# EAGLE design MiSTer_LLOAD (EAGLE 6.6.0)
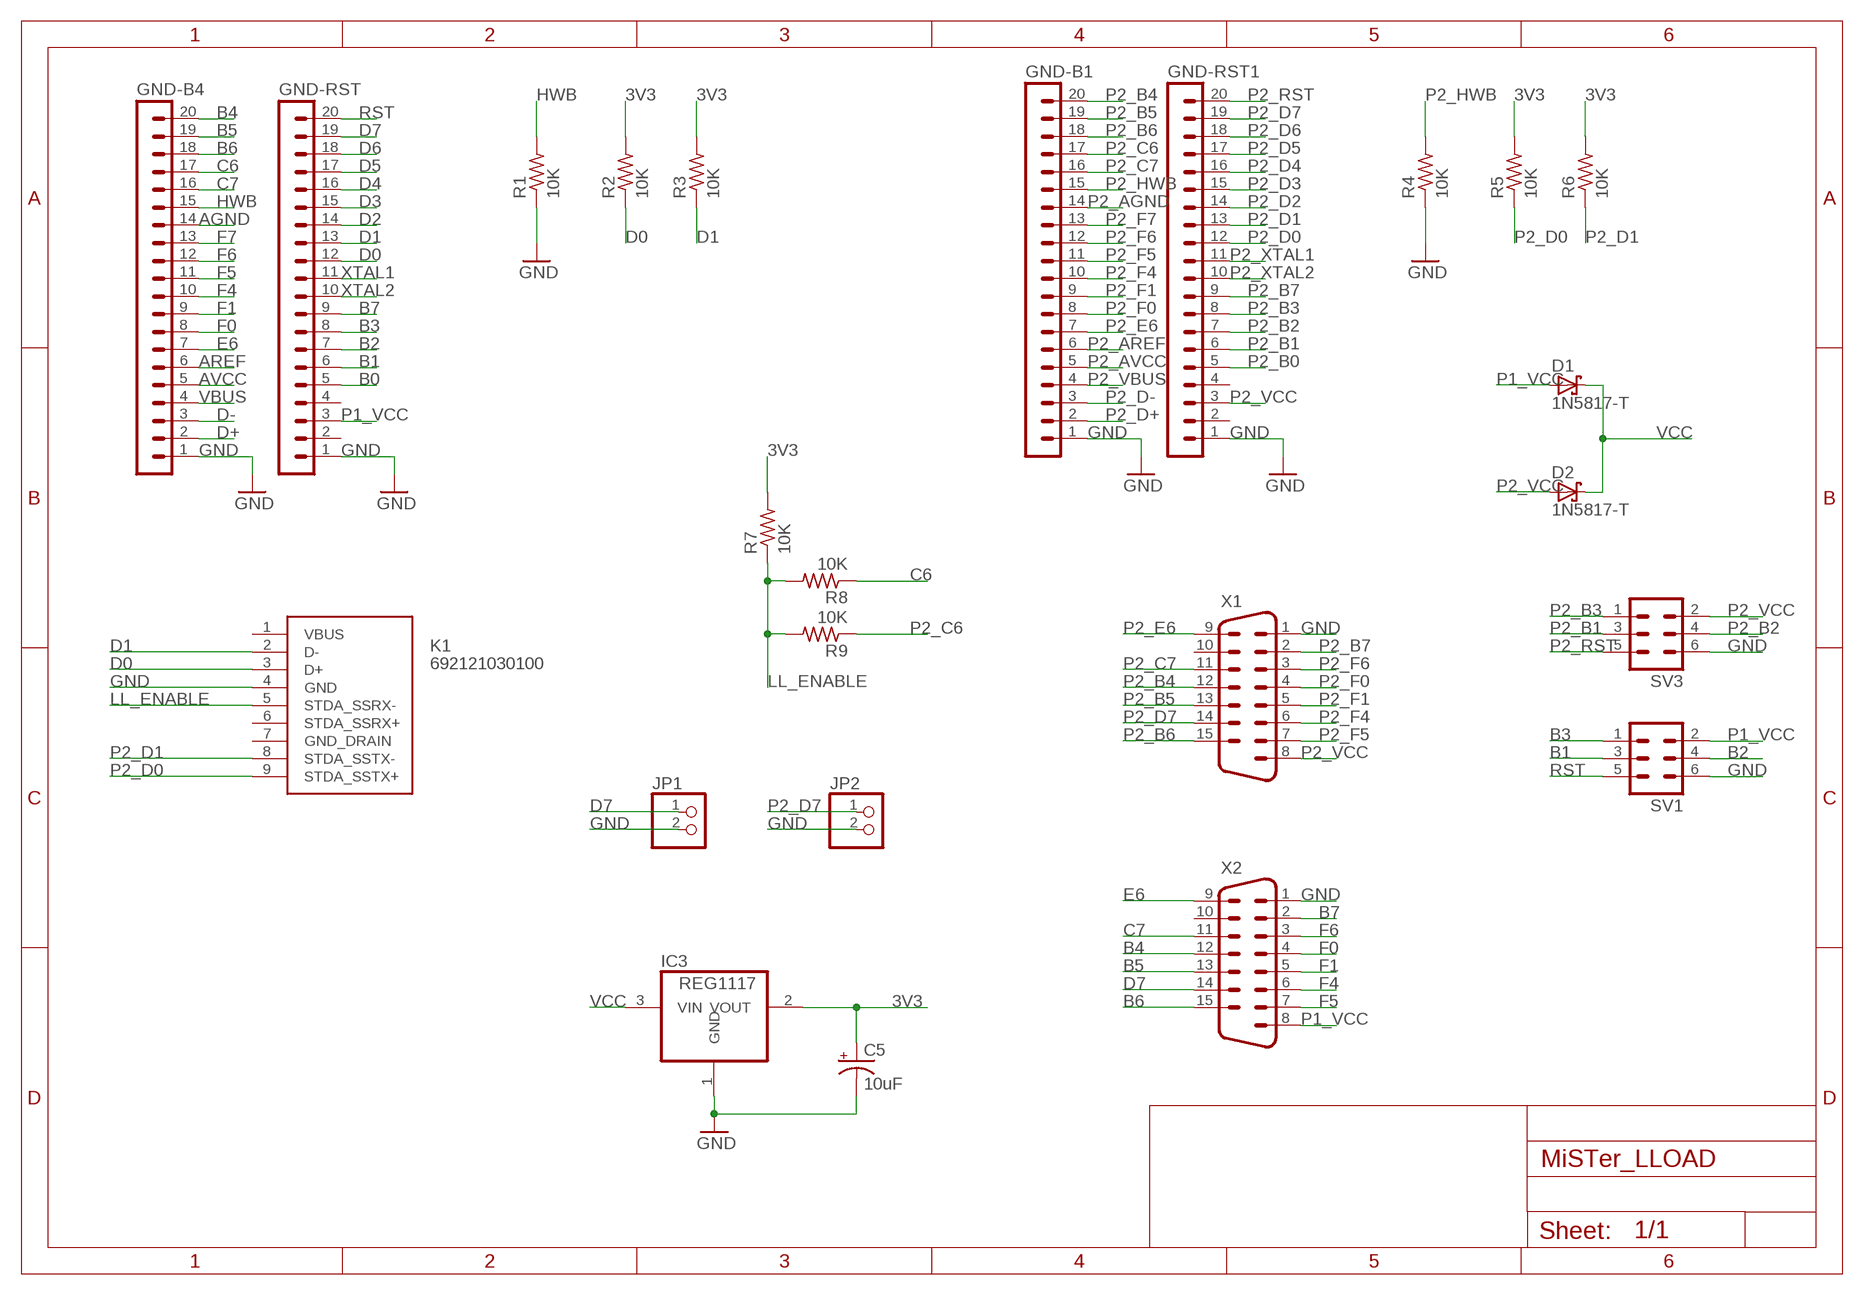
[diagram p0: schematic, sheet 1]

## Parts
C5  10uF  CPOL-USE2.5-6  [E2,5-6]
D1  1N5817-T  [DO41-7.6]
D2  1N5817-T  [DO41-7.6]
GND-B1  MA20-1  [MA20-1]
GND-B4  MA20-1  [MA20-1]
GND-RST  MA20-1  [MA20-1]
GND-RST1  MA20-1  [MA20-1]
IC3  REG1117  [SOT223]
JP1  PINHD-1X2  [1X02]
JP2  PINHD-1X2  [1X02]
K1  692121030100  [692121030100]
R1  10K  R-US_0207/10  [0207/10]
R2  10K  R-US_0207/10  [0207/10]
R3  10K  R-US_0207/10  [0207/10]
R4  10K  R-US_0207/10  [0207/10]
R5  10K  R-US_0207/10  [0207/10]
R6  10K  R-US_0207/10  [0207/10]
R7  10K  R-US_0207/10  [0207/10]
R8  10K  R-US_0207/10  [0207/10]
R9  10K  R-US_0207/10  [0207/10]
SV1  MA03-2  [MA03-2]
SV3  MA03-2  [MA03-2]
X1  M15HP  [M15HP]
X2  M15HP  [M15HP]

## Nets
3V3: C5.+ IC3.2(VOUT) R2.2 R3.2 R5.2 R6.2 R7.2
AGND: GND-B4.14
AREF: GND-B4.6
AVCC: GND-B4.5
B0: GND-RST.5
B1: GND-RST.6 SV1.3
B2: GND-RST.7 SV1.4
B3: GND-RST.8 SV1.1
B4: GND-B4.20 X2.12
B5: GND-B4.19 X2.13
B6: GND-B4.18 X2.15
B7: GND-RST.9 X2.2
C6: GND-B4.17 R8.1
C7: GND-B4.16 X2.11
D0: GND-RST.12 K1.3(D+) R2.1
D1: GND-RST.13 K1.2(D-) R3.1
D2: GND-RST.14
D3: GND-RST.15
D4: GND-RST.16
D5: GND-RST.17
D6: GND-RST.18
D7: GND-RST.19 JP1.1 X2.14
D+: GND-B4.2
D-: GND-B4.3
E6: GND-B4.7 X2.9
F0: GND-B4.8 X2.4
F1: GND-B4.9 X2.5
F4: GND-B4.10 X2.6
F5: GND-B4.11 X2.7
F6: GND-B4.12 X2.3
F7: GND-B4.13
GND: C5.- GND-B1.1 GND-B4.1 GND-RST1.1 GND-RST.1 IC3.1(GND) JP1.2 JP2.2 K1.4(GND) R1.1 R4.1 SV1.6 SV3.6 X1.1 X2.1
HWB: GND-B4.15 R1.2
LL_ENABLE: K1.5(STDA_SSRX-) R7.1 R8.2 R9.2
P1_VCC: D1.A GND-RST.3 SV1.2 X2.8
P2_AGND: GND-B1.14
P2_AREF: GND-B1.6
P2_AVCC: GND-B1.5
P2_B0: GND-RST1.5
P2_B1: GND-RST1.6 SV3.3
P2_B2: GND-RST1.7 SV3.4
P2_B3: GND-RST1.8 SV3.1
P2_B4: GND-B1.20 X1.12
P2_B5: GND-B1.19 X1.13
P2_B6: GND-B1.18 X1.15
P2_B7: GND-RST1.9 X1.2
P2_C6: GND-B1.17 R9.1
P2_C7: GND-B1.16 X1.11
P2_D0: GND-RST1.12 K1.9(STDA_SSTX+) R5.1
P2_D1: GND-RST1.13 K1.8(STDA_SSTX-) R6.1
P2_D2: GND-RST1.14
P2_D3: GND-RST1.15
P2_D4: GND-RST1.16
P2_D5: GND-RST1.17
P2_D6: GND-RST1.18
P2_D7: GND-RST1.19 JP2.1 X1.14
P2_D+: GND-B1.2
P2_D-: GND-B1.3
P2_E6: GND-B1.7 X1.9
P2_F0: GND-B1.8 X1.4
P2_F1: GND-B1.9 X1.5
P2_F4: GND-B1.10 X1.6
P2_F5: GND-B1.11 X1.7
P2_F6: GND-B1.12 X1.3
P2_F7: GND-B1.13
P2_HWB: GND-B1.15 R4.2
P2_RST: GND-RST1.20 SV3.5
P2_VBUS: GND-B1.4
P2_VCC: D2.A GND-RST1.3 SV3.2 X1.8
P2_XTAL1: GND-RST1.11
P2_XTAL2: GND-RST1.10
RST: GND-RST.20 SV1.5
VBUS: GND-B4.4
VCC: D1.C D2.C IC3.3(VIN)
XTAL1: GND-RST.11
XTAL2: GND-RST.10
Unconnected: GND-RST1.2 GND-RST1.4 GND-RST.2 GND-RST.4 K1.1(VBUS) K1.6(STDA_SSRX+) K1.7(GND_DRAIN) X1.10 X2.10

## Library data of the parts
C5 = rcl:CPOL-US: POLARIZED CAPACITOR, American symbol
D1 D2 = diode:1N581*: 1.0A SCHOTTKY BARRIER RECTIFIER Source: http://www.diodes.com/datasheets/ds23001.pdf
GND-B1 GND-B4 GND-RST GND-RST1 = con-lstb:MA20-1: PIN HEADER; OC_FARNELL: unknown; OC_NEWARK: unknown
IC3 = burr-brown:REG1117: 800mA and 1A Low Dropout (LDO) Positive Regulator 1.8V, 2.5V, 2.85V, 3.3V, 5V, and Adj; MPN: REG1117; OC_FARNELL: 1097566; OC_NEWARK: 14P6981
JP1 JP2 = pinhead:PINHD-1X2: PIN HEADER
K1 = wuerth:692121030100: WR-COM USB 3.0 HORIZONTAL TYPE A
R1-R9 = rcl:R-US_: RESISTOR, American symbol
SV1 SV3 = con-lstb:MA03-2: PIN HEADER; OC_FARNELL: unknown; OC_NEWARK: unknown
X1 X2 = con-subd:M15: SUB-D; OC_FARNELL: unknown; OC_NEWARK: unknown

## Board
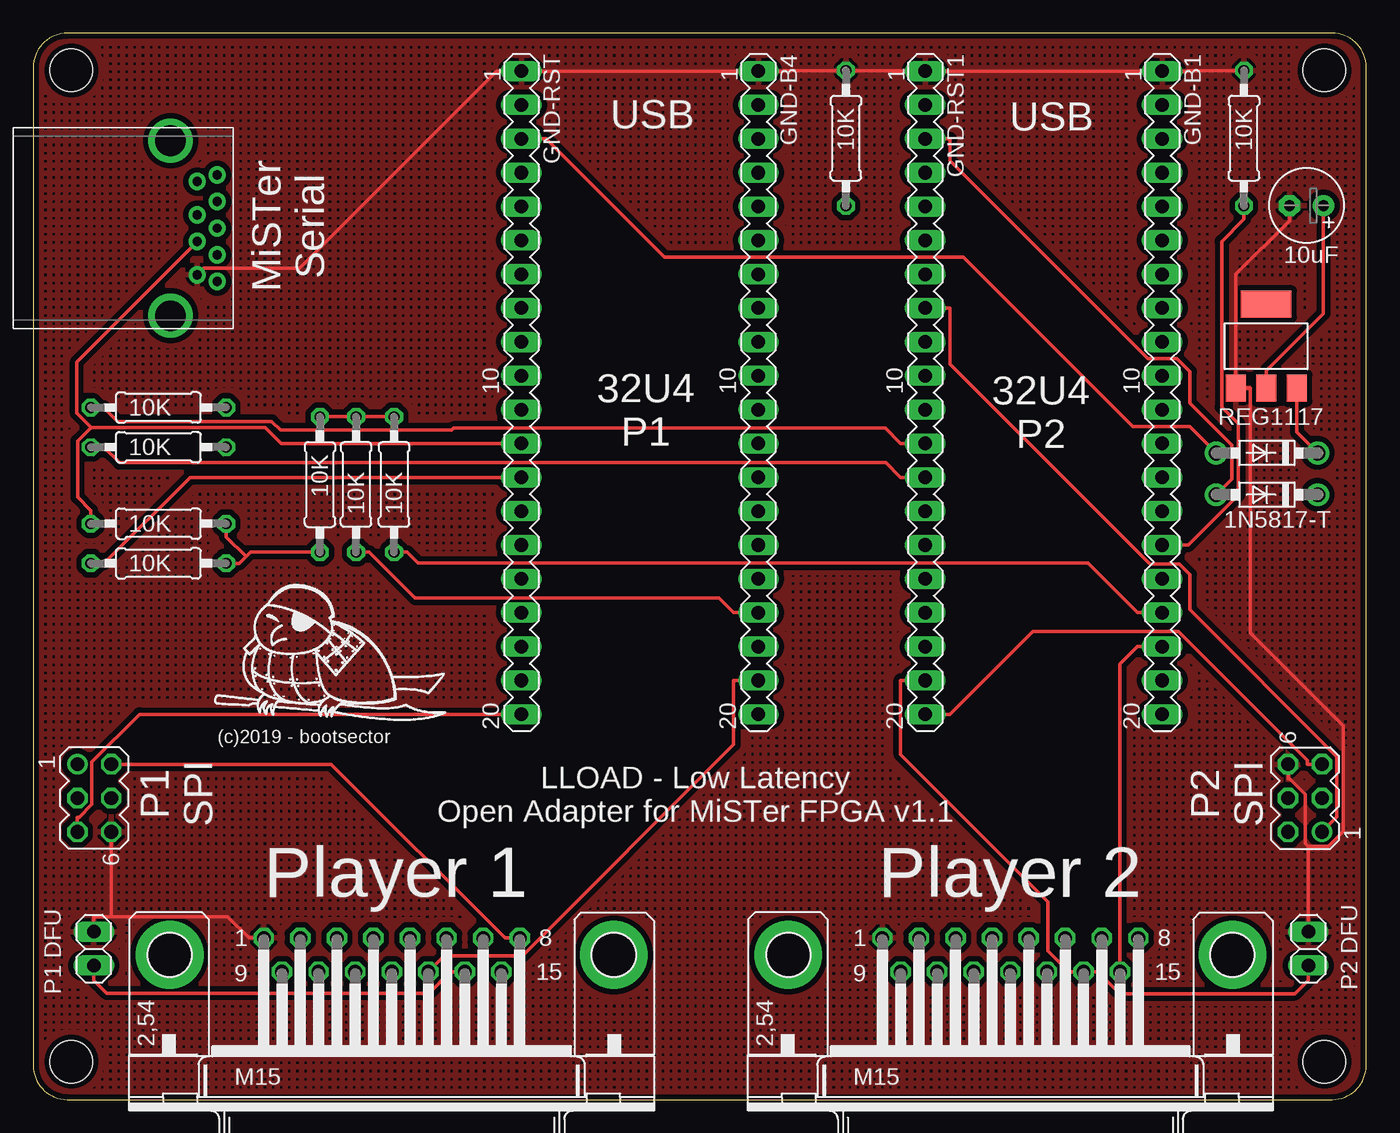
[diagram p1: board, top side]
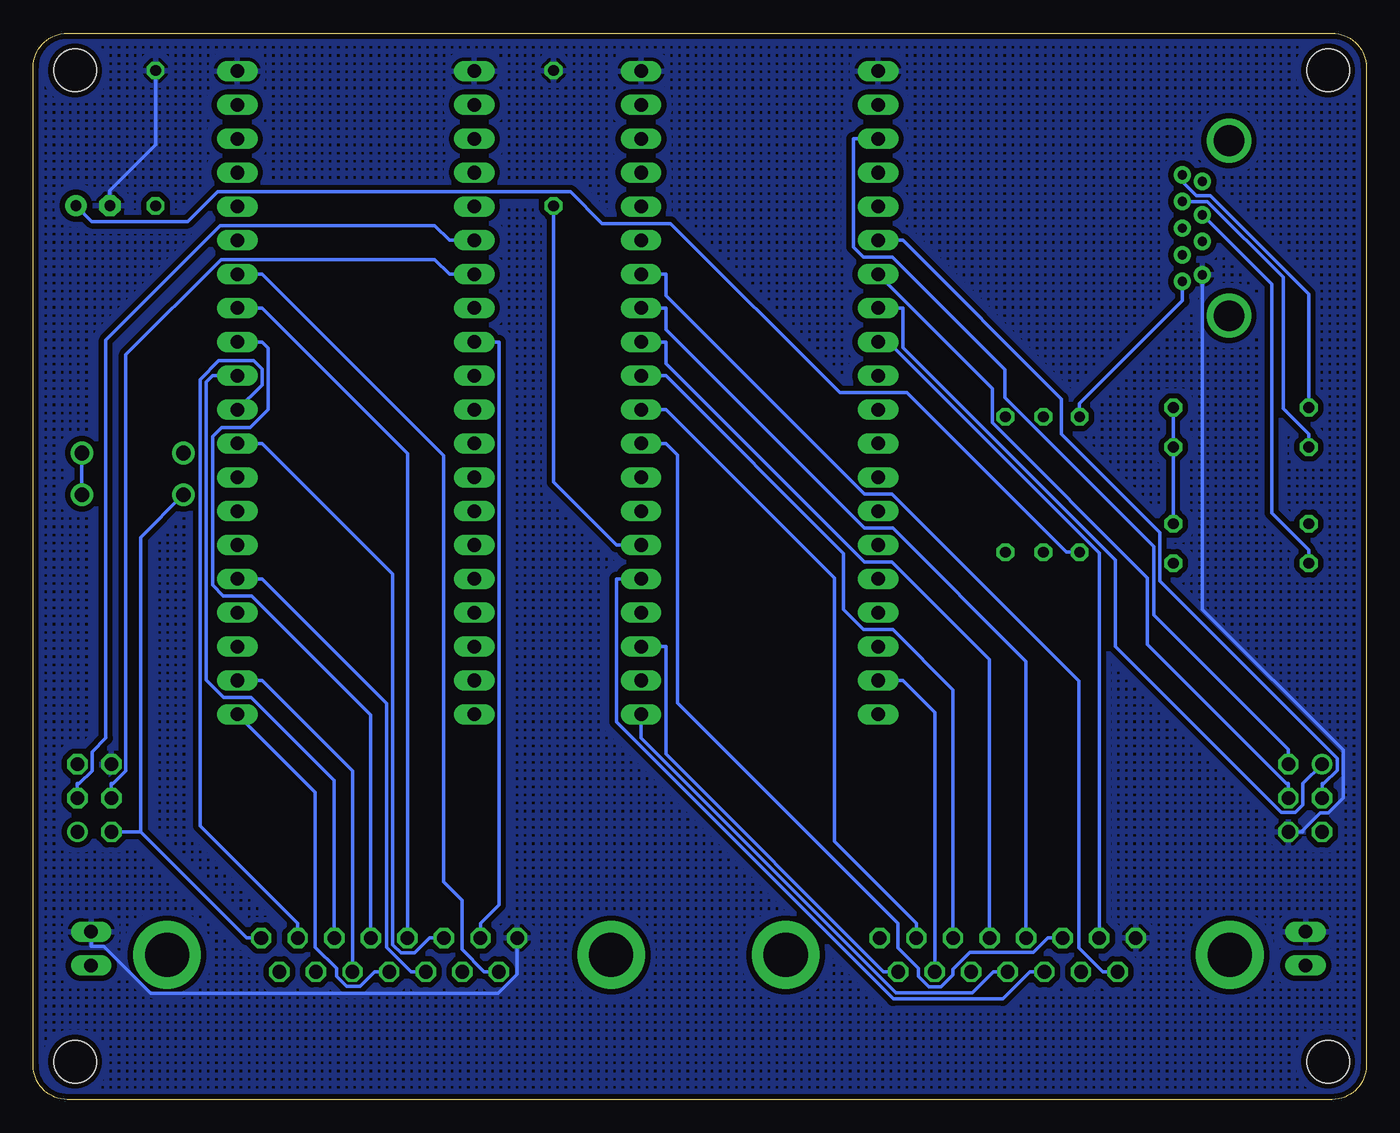
[diagram p2: board, bottom side, seen from below]

Size 100 x 80 mm. Coordinates in mm from the lower left corner, seen from the top.
Outline: 0,77.46 0,2.54 arc90 2.54,0 97.46,0 arc90 100,2.54 100,77.46 arc90 97.46,80 2.54,80 arc90 0,77.46
Copper layers (1*16): Top 0.035mm / dielectric 1.5mm / Bottom 0.035mm
Design rules "SeeedStudio_2layer_DRU_no_angle_20140221": minimum track width 6mil, minimum drill 12mil, track to track 6mil, track to pad 6mil, pad to pad 6mil, via to via 6mil, smd to smd 0mil, copper to edge 10mil, drill to drill 10mil, minimum pad ring 10mil, minimum via ring 6mil, stop-mask expansion 2mil, vias tented up to drill 100mil, thermal gap 10mil
Holes 3.2 mm at 2.85,77.22 2.85,2.85 96.87,2.85 96.87,77.22

### Footprints (pad centres in the part's own frame; a part is rotated, then mirrored left to right if it is on the bottom)
E2,5-6 = drill 0.813 pad 1.6: + -1.27,0 | drill 0.813 pad 1.6 octagon: - 1.27,0
DO41-7.6 = drill 1.1 pad 1.7: A 3.81,0; C -3.81,0
MA20-1 = drill 1.016 long: 1 -24.13,0; 2 -21.59,0; 3 -19.05,0; 4 -16.51,0; 5 -13.97,0; 6 -11.43,0; 7 -8.89,0; 8 -6.35,0; 9 -3.81,0; 10 -1.27,0; 11 1.27,0; 12 3.81,0; 13 6.35,0; 14 8.89,0; 15 11.43,0; 16 13.97,0; 17 16.51,0; 18 19.05,0; 19 21.59,0; 20 24.13,0
SOT223 = smd 1.499 x 2.007: 1 -2.261,-3.15; 2 0.025,-3.15; 3 2.311,-3.15 | smd 3.81 x 2.007: 4 0,3.15
1X02 = drill 1.016 long: 1 -1.27,0; 2 1.27,0
692121030100 = drill 0.7 pad 1.3: 1 3.5,1.5; 2 1,1.5; 3 -1,1.5; 4 -3.5,1.5; 5 -4,0; 6 -2,0; 7 0,0; 8 2,0; 9 4,0 | drill 2.3 pad 3.3: Z1 -6.57,3.5; Z2 6.57,3.5
0207/10 = drill 0.813 octagon: 1 -5.08,0; 2 5.08,0
MA03-2 = drill 1.016: 1 -2.54,-1.27 | drill 1.016 octagon: 2 -2.54,1.27; 3 0,-1.27; 4 0,1.27; 5 2.54,-1.27; 6 2.54,1.27
M15HP = drill 1.016 octagon: 1 -9.601,1.27; 2 -6.858,1.27; 3 -4.115,1.27; 4 -1.372,1.27; 5 1.372,1.27; 6 4.115,1.27; 7 6.858,1.27; 8 9.601,1.27; 9 -8.23,-1.27; 10 -5.486,-1.27; 11 -2.743,-1.27; 12 0,-1.27; 13 2.743,-1.27; 14 5.486,-1.27; 15 8.23,-1.27 | drill 3.302 pad 5.08: G1 -16.662,0; G2 16.662,0

### Placement (x,y rotation side)
C5  95.52,67.07 180 top
D1  92.55,48.51 180 top
D2  92.55,45.38 180 top
GND-B1  84.7,53.04 270 top
GND-B4  54.4,53.04 270 top
GND-RST  36.62,53.04 270 top
GND-RST1  66.92,53.04 270 top
IC3  92.49,56.53 0 top
JP1  4.54,11.32 90 top
JP2  95.66,11.32 90 top
K1  13.79,65.38 90 top
R1  60.97,72.13 270 top
R2  9.39,43.21 0 top
R3  9.39,40.23 0 top
R4  90.83,72.13 270 top
R5  9.39,51.92 0 top
R6  9.39,48.95 0 top
R7  21.5,46.15 270 top
R8  24.22,46.15 90 top
R9  27.07,46.15 90 top
SV1  4.57,22.62 270 top
SV3  95.42,22.62 90 top
X1  73.3,10.85 0 top
X2  26.89,10.85 0 top

### Tracks (layer width: path | path; a pad name or v marks a point on that pad's centre or on a via)
3V3
  Top 0.254: C5.+ 96.79,58.99 92.52,54.71 IC3.2 | 15.95,40.73 16.29,41.07 R7.2 | 15.95,40.73 15.46,40.23 R3.2 | 15.95,40.73 14.47,42.22 R2.2
  Bottom 0.254: C5.+ 95.6,65.88 88.42,65.88 86.19,68.11 59.69,68.11 57.32,65.73 52.19,65.73 39.49,53.03 34.46,53.03 22.49,41.07 R7.2 | R2.2 R6.2 R5.2
B1
  Bottom 0.254: GND-RST.6 34.77,64.47 22.86,52.56 22.86,49.92 15.49,42.55 15.49,38.89 2.18,25.58 2.18,24.7 3.17,23.71 3.3,23.71 SV1.3
B2
  Bottom 0.254: SV1.4 5.84,23.71 5.98,23.71 16.4,34.14 16.4,39.13 28.06,50.78 28.06,53.36 GND-RST.7
B3
  Bottom 0.254: GND-RST.8 34.77,59.38 34.77,56.41 18.84,40.47 18.84,34 6.36,21.53 5.33,21.53 4.75,22.11 4.75,23.71 SV1.1
B4
  Bottom 0.254: GND-B4.20 54.4,27.12 35.29,8.02 29.55,8.02 27.98,9.58 X2.12
B5
  Top 0.254: GND-B4.19 52.55,31.45 52.55,26.63 36.69,10.77 30.82,10.77 X2.13
B6
  Bottom 0.254: GND-B4.18 52.55,33.98 52.55,25.92 36.21,9.58 X2.15
B7
  Bottom 0.254: X2.2 20.03,13.21 20.03,41.02 35.85,56.84 GND-RST.9
C6
  Top 0.254: GND-B4.17 52.55,36.52 51.45,37.62 28.66,37.62 25.21,41.07 R8.1
C7
  Bottom 0.254: GND-B4.16 56.26,39.06 56.26,28.33 35.47,7.55 27.27,7.55 25.24,9.58 X2.11
D0
  Top 0.254: 4.33,50.42 17.38,50.42 18.58,49.23 GND-RST.12 | 4.33,50.42 3.31,49.41 3.31,45.19 4.31,44.2 R2.1 | 4.33,50.42 3.26,51.49 3.26,55.35 K1.3
D1
  Top 0.254: R3.1 5.3,40.23 11.75,46.69 GND-RST.13
  Bottom 0.254: R3.1 4.31,41.22 7.1,44.01 7.1,61.18 K1.2
D7
  Top 0.254: JP1.1 4.54,8.96 5.52,7.98 29.68,7.98 31.28,9.58 X2.14
  Bottom 0.254: X2.14 32.38,29.05 34.77,31.45 GND-RST.19
E6
  Bottom 0.254: X2.9 19.75,9.58 21.56,11.39 21.56,31.41 35.57,45.41 37.66,45.41 52.55,60.3 52.55,61.92 GND-B4.7
F0
  Bottom 0.254: GND-B4.8 52.55,59.38 52.55,57.76 37.66,42.88 35.52,42.88 25.52,32.88 X2.4
F1
  Bottom 0.254: GND-B4.9 52.55,56.84 52.55,55.22 37.66,40.34 35.58,40.34 28.26,33.01 X2.5
F4
  Bottom 0.254: GND-B4.10 52.55,54.3 39.22,40.98 39.22,36.77 37.7,35.26 35.52,35.26 31,30.74 X2.6
F5
  Bottom 0.254: GND-B4.11 52.55,51.77 39.9,39.12 39.9,19.37 33.75,13.21 X2.7
F6
  Bottom 0.254: GND-B4.12 52.55,49.23 51.66,48.34 51.66,29.76 35.12,13.21 35.12,11.36 33.59,9.83 33.59,9.25 32.81,8.47 31.89,8.47 31,9.36 31,9.76 29.73,11.03 24.96,11.03 23.87,12.12 X2.3
GND
  Top 0.254: 95.66,18.99 97.14,18.99 98.26,20.11 98.26,28.05 91.31,35 91.31,53.38 IC3.1 90.23,61.92 94.25,65.94 C5.- | 95.66,18.99 95.42,19.23 95.42,22.91 94.26,24.07 94.15,24.07 SV3.6 | 95.66,18.99 95.66,13.69 JP2.2 | 5.84,13.72 4.58,13.72 4.54,13.69 JP1.2 | 5.84,13.72 14.6,13.72 16.2,12.12 X2.1 | 5.84,13.72 SV1.6 | K1.4 12.79,62.38 19.98,62.38 34.77,77.17 GND-RST.1 GND-B4.1 56.26,77.17 56.3,77.21 R1.1 65.02,77.21 65.06,77.17 GND-RST1.1 GND-B1.1 86.55,77.17 86.6,77.21 R4.1
  Bottom 0.254: JP2.2 95.66,11.5 94.72,11.5 91.19,7.97 65.13,7.97 63.7,9.39 X1.1 | K1.4 12.29,36.78 1.72,26.21 1.72,22.63 2.84,21.51 3.43,21.51 4.75,20.19 4.75,20.08 SV1.6 | C5.- 94.25,68.2 90.83,71.63 R4.1
  pour Bottom (isolate 0.406, hatched): -0.15,79.95 100.04,79.95 100.04,-0.15 -0.15,-0.15
  pour Top (isolate 0.406, hatched): -0.15,80.21 100.36,80.21 100.36,-0.15 -0.15,-0.15
HWB
  Bottom 0.254: GND-B4.15 56.26,41.6 60.97,46.31 R1.2
LL_ENABLE
  Top 0.254: R7.1 R8.2 R9.2
  Bottom 0.254: R7.1 21.5,52.22 13.79,59.93 K1.5
P1_VCC
  Top 0.254: GND-RST.3 38.48,72.08 47.37,63.2 69.79,63.2 82.49,50.49 86.76,50.49 D1.A | X2.8 35.4,12.12 22.36,25.16 SV1.2
  Bottom 0.254: GND-RST.3 38.48,72.08 38.48,63.97 37.7,63.2 35.53,63.2 27.09,54.76 27.09,52.66 15.95,41.51 15.95,36.36 5.84,26.25 SV1.2
P2_B1
  Bottom 0.254: GND-RST1.6 68.77,64.47 69.88,65.57 85.97,65.57 94.56,56.98 94.56,27.11 95.59,26.08 95.59,24.67 96.55,23.71 96.69,23.71 SV3.3
P2_B2
  Bottom 0.254: GND-RST1.7 68.77,61.92 69.88,63.03 85.91,63.03 93.06,55.88 93.06,24.67 94.01,23.71 94.15,23.71 SV3.4
P2_B3
  Top 0.254: GND-RST1.8 68.77,59.38 68.77,55.18 83.78,40.17 85.98,40.17 86.78,39.38 86.78,36.76 97.81,25.73 97.81,21.2 SV3.1
P2_B4
  Bottom 0.254: X1.12 74.4,9.58 75.49,8.48 76.5,8.48 77.26,9.25 77.26,9.83 78.86,11.43 78.86,23.06 GND-B1.20
P2_B5
  Bottom 0.254: GND-B1.19 82.84,31.45 76.05,24.65 X1.13
P2_B6
  Top 0.254: GND-B1.18 82.84,33.98 81.53,32.67 X1.15
P2_B7
  Bottom 0.254: GND-RST1.9 65.06,56.84 65.06,14.6 66.45,13.21 X1.2
P2_C6
  Top 0.254: GND-B1.17 82.84,36.52 79.12,40.25 28.87,40.25 28.06,41.07 R9.1
P2_C7
  Bottom 0.254: GND-B1.16 82.84,39.06 73.5,29.72 73.5,11.42 71.65,9.58 X1.11
P2_D0
  Top 0.254: GND-RST1.12 65.06,49.23 63.92,50.37 31.53,50.37 31.4,50.24 18.54,50.24 17.9,50.88 6.34,50.88 5.3,51.92 R5.1
  Bottom 0.254: R5.1 4.31,60.45 11.7,67.84 12.75,67.84 13.79,68.88 K1.9
P2_D1
  Top 0.254: R6.1 5.3,48.95 6.47,47.78 63.97,47.78 65.06,46.69 GND-RST1.13
  Bottom 0.254: K1.8 11.9,67.38 6.21,61.69 6.21,51.85 4.31,49.94 R6.1
P2_D7
  Top 0.254: GND-RST1.19 65.06,31.45 65.06,25.88 76.11,14.83 76.11,11.17 77.7,9.58 X1.14 79.34,9.58 79.88,9.58 81.53,7.93 94.63,7.93 95.66,8.96 JP2.1
P2_E6
  Bottom 0.254: GND-B1.7 82.84,61.92 69.23,48.31 69.23,16.32 67.84,14.93 67.84,11.25 66.17,9.58 X1.9
P2_F0
  Bottom 0.254: GND-B1.8 82.84,59.38 71.93,48.47 71.93,13.21 X1.4
P2_F1
  Bottom 0.254: X1.5 74.68,28.85 83.62,37.8 85.74,37.8 86.55,38.61 86.55,49.73 85.85,50.43 83.72,50.43 82.39,51.76 82.39,56.39 82.84,56.84 GND-B1.9
P2_F4
  Bottom 0.254: GND-B1.10 86.55,54.3 87.04,53.82 87.04,31.48 85.74,30.18 83.65,30.18 77.42,23.94 X1.6
P2_F5
  Bottom 0.254: X1.7 80.16,13.21 87.5,20.55 87.5,54.02 86.08,55.43 83.45,55.43 82.84,54.82 82.84,53.62 GND-B1.11
P2_F6
  Bottom 0.254: GND-B1.12 82.84,49.23 73.04,39.42 73.04,11.61 72.42,10.99 71.41,10.99 70.28,12.12 X1.3
P2_HWB
  Top 0.254: R4.2 90.83,66.06 89.15,64.38 89.15,51.97 90.39,50.73 90.39,45.35 86.64,41.6 GND-B1.15
P2_RST
  Top 0.254: GND-RST1.20 68.77,28.91 75,35.13 85.9,35.13 95.59,25.43 95.59,25.16 SV3.5
P2_VCC
  Top 0.254: GND-RST1.3 68.77,72.08 68.77,70.43 83.63,55.58 85.81,55.58 86.78,54.61 86.78,52.26 89.93,49.1 89.93,46.57 D2.A
  Bottom 0.254: D2.A 91.96,42.17 91.96,20.08 | 91.96,20.08 84,12.12 X1.8 | SV3.2 91.96,20.08
RST
  Top 0.254: SV1.5 3.3,21.17 3.44,21.17 4.39,22.13 4.39,25.32 7.97,28.91 GND-RST.20
VCC
  Top 0.254: IC3.3 94.8,50.07 D1.C
  Bottom 0.254: D2.C D1.C

### Text on the board
tPlace: USB | USB | MiSTer / Serial | 32U4 / P1 | 32U4 / P2 | (c)2019 - bootsector | P1 / SPI | LLOAD - Low Latency / Open Adapter for MiSTer FPGA v1.1 | P2 / SPI | Player 1 | Player 2 | P1 DFU | P2 DFU